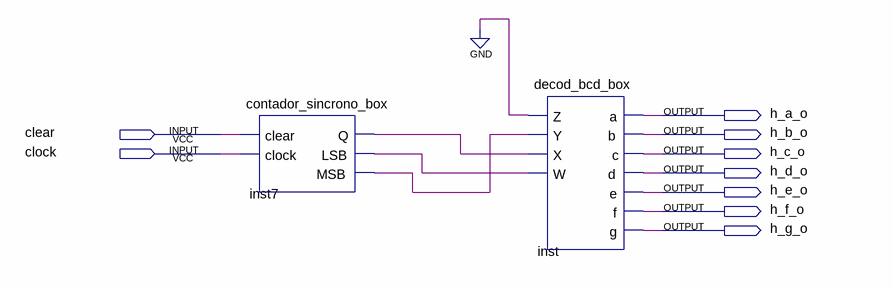
[diagram p0: schematic sheet]
// Quartus schematic contador_sincrono.bdf as structural Verilog: 2 symbols, 9 pins
module contador_sincrono (
  input  clear,
  input  clock,
  output h_a_o,
  output h_b_o,
  output h_c_o,
  output h_d_o,
  output h_e_o,
  output h_f_o,
  output h_g_o
);

  wire inst7_lsb, inst7_msb, inst7_q;

  contador_sincrono_box inst7 (.clear(clear), .clock(clock), .Q(inst7_q), .LSB(inst7_lsb), .MSB(inst7_msb));
  decod_bcd_box inst (
    .Z(1'b0), .Y(inst7_msb), .X(inst7_q), .W(inst7_lsb), .a(h_a_o), .b(h_b_o), .c(h_c_o), .d(h_d_o),
    .e(h_e_o), .f(h_f_o), .g(h_g_o));
endmodule
